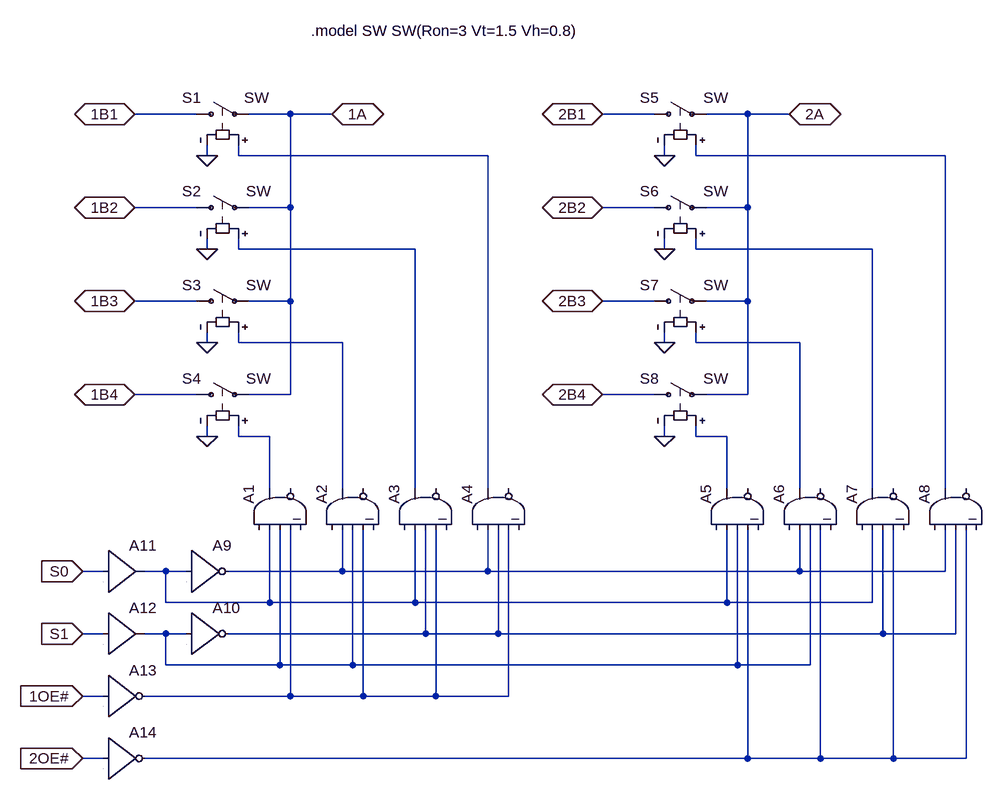
[diagram p0: schematic SN74CBT3253C.asc]
SN74CBT3253C.asc, the LTspice schematic file:
Version 4
SHEET 1 1616 1176
WIRE 48 112 -48 112
WIRE 192 112 128 112
WIRE 256 112 192 112
WIRE 752 112 672 112
WIRE 896 112 832 112
WIRE 960 112 896 112
WIRE 64 176 64 160
WIRE 112 176 112 160
WIRE 496 176 112 176
WIRE 768 176 768 160
WIRE 816 176 816 160
WIRE 1200 176 816 176
WIRE 48 256 -48 256
WIRE 192 256 192 112
WIRE 192 256 128 256
WIRE 752 256 672 256
WIRE 896 256 896 112
WIRE 896 256 832 256
WIRE 64 320 64 304
WIRE 112 320 112 304
WIRE 384 320 112 320
WIRE 768 320 768 304
WIRE 816 320 816 304
WIRE 1088 320 816 320
WIRE 48 400 -48 400
WIRE 192 400 192 256
WIRE 192 400 128 400
WIRE 752 400 672 400
WIRE 896 400 896 256
WIRE 896 400 832 400
WIRE 64 464 64 448
WIRE 112 464 112 448
WIRE 272 464 112 464
WIRE 768 464 768 448
WIRE 816 464 816 448
WIRE 976 464 816 464
WIRE 48 544 -48 544
WIRE 192 544 192 400
WIRE 192 544 128 544
WIRE 752 544 672 544
WIRE 896 544 896 400
WIRE 896 544 832 544
WIRE 64 608 64 592
WIRE 112 608 112 592
WIRE 160 608 112 608
WIRE 768 608 768 592
WIRE 816 608 816 592
WIRE 864 608 816 608
WIRE 160 688 160 608
WIRE 272 688 272 464
WIRE 384 688 384 320
WIRE 496 688 496 176
WIRE 864 688 864 608
WIRE 976 688 976 464
WIRE 1088 688 1088 320
WIRE 1200 688 1200 176
WIRE -96 816 -128 816
WIRE 0 816 -32 816
WIRE 32 816 0 816
WIRE 272 816 272 752
WIRE 272 816 96 816
WIRE 496 816 496 752
WIRE 496 816 272 816
WIRE 976 816 976 752
WIRE 976 816 496 816
WIRE 1200 816 1200 752
WIRE 1200 816 976 816
WIRE 0 864 0 816
WIRE 160 864 160 752
WIRE 160 864 0 864
WIRE 384 864 384 752
WIRE 384 864 160 864
WIRE 864 864 864 752
WIRE 864 864 384 864
WIRE 1088 864 1088 752
WIRE 1088 864 864 864
WIRE -96 912 -128 912
WIRE 0 912 -32 912
WIRE 32 912 0 912
WIRE 400 912 400 752
WIRE 400 912 96 912
WIRE 512 912 512 752
WIRE 512 912 400 912
WIRE 1104 912 1104 752
WIRE 1104 912 512 912
WIRE 1216 912 1216 752
WIRE 1216 912 1104 912
WIRE 0 960 0 912
WIRE 176 960 176 752
WIRE 176 960 0 960
WIRE 288 960 288 752
WIRE 288 960 176 960
WIRE 880 960 880 752
WIRE 880 960 288 960
WIRE 992 960 992 752
WIRE 992 960 880 960
WIRE -96 1008 -128 1008
WIRE 192 1008 192 752
WIRE 192 1008 -32 1008
WIRE 304 1008 304 752
WIRE 304 1008 192 1008
WIRE 416 1008 416 752
WIRE 416 1008 304 1008
WIRE 528 1008 528 752
WIRE 528 1008 416 1008
WIRE -96 1104 -128 1104
WIRE 896 1104 896 752
WIRE 896 1104 -32 1104
WIRE 1008 1104 1008 752
WIRE 1008 1104 896 1104
WIRE 1120 1104 1120 752
WIRE 1120 1104 1008 1104
WIRE 1232 1104 1232 752
WIRE 1232 1104 1120 1104
FLAG 256 112 1A
IOPIN 256 112 BiDir
FLAG 672 112 2B1
IOPIN 672 112 BiDir
FLAG 672 256 2B2
IOPIN 672 256 BiDir
FLAG 672 400 2B3
IOPIN 672 400 BiDir
FLAG 672 544 2B4
IOPIN 672 544 BiDir
FLAG 960 112 2A
IOPIN 960 112 BiDir
FLAG -128 816 S0
IOPIN -128 816 In
FLAG -128 912 S1
IOPIN -128 912 In
FLAG -128 1008 1OE#
IOPIN -128 1008 In
FLAG -128 1104 2OE#
IOPIN -128 1104 In
FLAG 64 608 0
FLAG 64 176 0
FLAG 64 320 0
FLAG 64 464 0
FLAG 768 176 0
FLAG 768 320 0
FLAG 768 464 0
FLAG 768 608 0
FLAG -48 112 1B1
IOPIN -48 112 BiDir
FLAG -48 256 1B2
IOPIN -48 256 BiDir
FLAG -48 400 1B3
IOPIN -48 400 BiDir
FLAG -48 544 1B4
IOPIN -48 544 BiDir
SYMBOL sw 32 112 R270
WINDOW 0 25 23 VLeft 2
WINDOW 3 25 89 VRight 2
SYMATTR InstName S1
SYMBOL sw 32 256 R270
WINDOW 0 25 23 VLeft 2
WINDOW 3 25 92 VRight 2
SYMATTR InstName S2
SYMBOL sw 32 400 R270
WINDOW 0 25 23 VLeft 2
WINDOW 3 25 92 VRight 2
SYMATTR InstName S3
SYMBOL sw 32 544 R270
WINDOW 0 25 23 VLeft 2
WINDOW 3 25 92 VRight 2
SYMATTR InstName S4
SYMBOL sw 736 112 R270
WINDOW 0 25 23 VLeft 2
WINDOW 3 25 92 VRight 2
SYMATTR InstName S5
SYMBOL sw 736 256 R270
WINDOW 0 25 23 VLeft 2
WINDOW 3 25 92 VRight 2
SYMATTR InstName S6
SYMBOL sw 736 400 R270
WINDOW 0 25 23 VLeft 2
WINDOW 3 25 92 VRight 2
SYMATTR InstName S7
SYMBOL sw 736 544 R270
WINDOW 0 25 23 VLeft 2
WINDOW 3 25 92 VRight 2
SYMATTR InstName S8
SYMBOL Digital\\and 112 720 R270
WINDOW 3 0 0 Invisible 0
SYMATTR InstName A1
SYMATTR Value Vhigh=2.7 Vlow=0.4
SYMBOL Digital\\and 224 720 R270
WINDOW 3 0 0 Invisible 0
SYMATTR InstName A2
SYMATTR Value Vhigh=2.7 Vlow=0.4
SYMBOL Digital\\and 336 720 R270
WINDOW 3 0 0 Invisible 0
SYMATTR InstName A3
SYMATTR Value Vhigh=2.7 Vlow=0.4
SYMBOL Digital\\and 448 720 R270
WINDOW 3 0 0 Invisible 0
SYMATTR InstName A4
SYMATTR Value Vhigh=2.7 Vlow=0.4
SYMBOL Digital\\and 816 720 R270
WINDOW 3 0 0 Invisible 0
SYMATTR InstName A5
SYMATTR Value Vhigh=2.7 Vlow=0.4
SYMBOL Digital\\and 928 720 R270
WINDOW 3 0 0 Invisible 0
SYMATTR InstName A6
SYMATTR Value Vhigh=2.7 Vlow=0.4
SYMBOL Digital\\and 1040 720 R270
WINDOW 3 0 0 Invisible 0
SYMATTR InstName A7
SYMATTR Value Vhigh=2.7 Vlow=0.4
SYMBOL Digital\\and 1152 720 R270
WINDOW 3 0 0 Invisible 0
SYMATTR InstName A8
SYMATTR Value Vhigh=2.7 Vlow=0.4
SYMBOL Digital\\inv 32 752 R0
WINDOW 3 0 0 Invisible 0
SYMATTR InstName A9
SYMATTR Value Vhigh=2.7 Vlow=0.4
SYMBOL Digital\\inv 32 848 R0
WINDOW 3 0 0 Invisible 0
SYMATTR InstName A10
SYMATTR Value Vhigh=2.7 Vlow=0.4
SYMBOL Digital\\buf1 -96 752 R0
WINDOW 3 0 0 Invisible 0
SYMATTR InstName A11
SYMATTR Value Vhigh=2.7 Vlow=0.4
SYMBOL Digital\\buf1 -96 848 R0
WINDOW 3 0 0 Invisible 0
SYMATTR InstName A12
SYMATTR Value Vhigh=2.7 Vlow=0.4
SYMBOL Digital\\inv -96 944 R0
WINDOW 3 0 0 Invisible 0
SYMATTR InstName A13
SYMATTR Value Vhigh=2.7 Vlow=0.4
SYMBOL Digital\\inv -96 1040 R0
WINDOW 3 0 0 Invisible 0
SYMATTR InstName A14
SYMATTR Value Vhigh=2.7 Vlow=0.4
TEXT 224 -16 Left 2 !.model SW SW(Ron=3 Vt=1.5 Vh=0.8)

The netlist it stands for:
* SN74CBT3253C.asc
S1 1B1 1A N001 0 SW
S2 1B2 1A N003 0 SW
S3 1B3 1A N005 0 SW
S4 1B4 1A N007 0 SW
S5 2B1 2A N002 0 SW
S6 2B2 2A N004 0 SW
S7 2B3 2A N006 0 SW
S8 2B4 2A N008 0 SW
A1 0 N009 N011 N013 0 0 N007 0 AND Vhigh=2.7 Vlow=0.4
A2 0 N010 N011 N013 0 0 N005 0 AND Vhigh=2.7 Vlow=0.4
A3 0 N009 N012 N013 0 0 N003 0 AND Vhigh=2.7 Vlow=0.4
A4 0 N010 N012 N013 0 0 N001 0 AND Vhigh=2.7 Vlow=0.4
A5 0 N009 N011 N014 0 0 N008 0 AND Vhigh=2.7 Vlow=0.4
A6 0 N010 N011 N014 0 0 N006 0 AND Vhigh=2.7 Vlow=0.4
A7 0 N009 N012 N014 0 0 N004 0 AND Vhigh=2.7 Vlow=0.4
A8 0 N010 N012 N014 0 0 N002 0 AND Vhigh=2.7 Vlow=0.4
A9 N009 0 0 0 0 N010 0 0 BUF Vhigh=2.7 Vlow=0.4
A10 N011 0 0 0 0 N012 0 0 BUF Vhigh=2.7 Vlow=0.4
A11 S0 0 0 0 0 0 N009 0 BUF Vhigh=2.7 Vlow=0.4
A12 S1 0 0 0 0 0 N011 0 BUF Vhigh=2.7 Vlow=0.4
A13 1OE# 0 0 0 0 N013 0 0 BUF Vhigh=2.7 Vlow=0.4
A14 2OE# 0 0 0 0 N014 0 0 BUF Vhigh=2.7 Vlow=0.4
.model SW SW(Ron=3 Vt=1.5 Vh=0.8)
.backanno
.end